# EAGLE schematic XADC_Example (EAGLE 6.2)
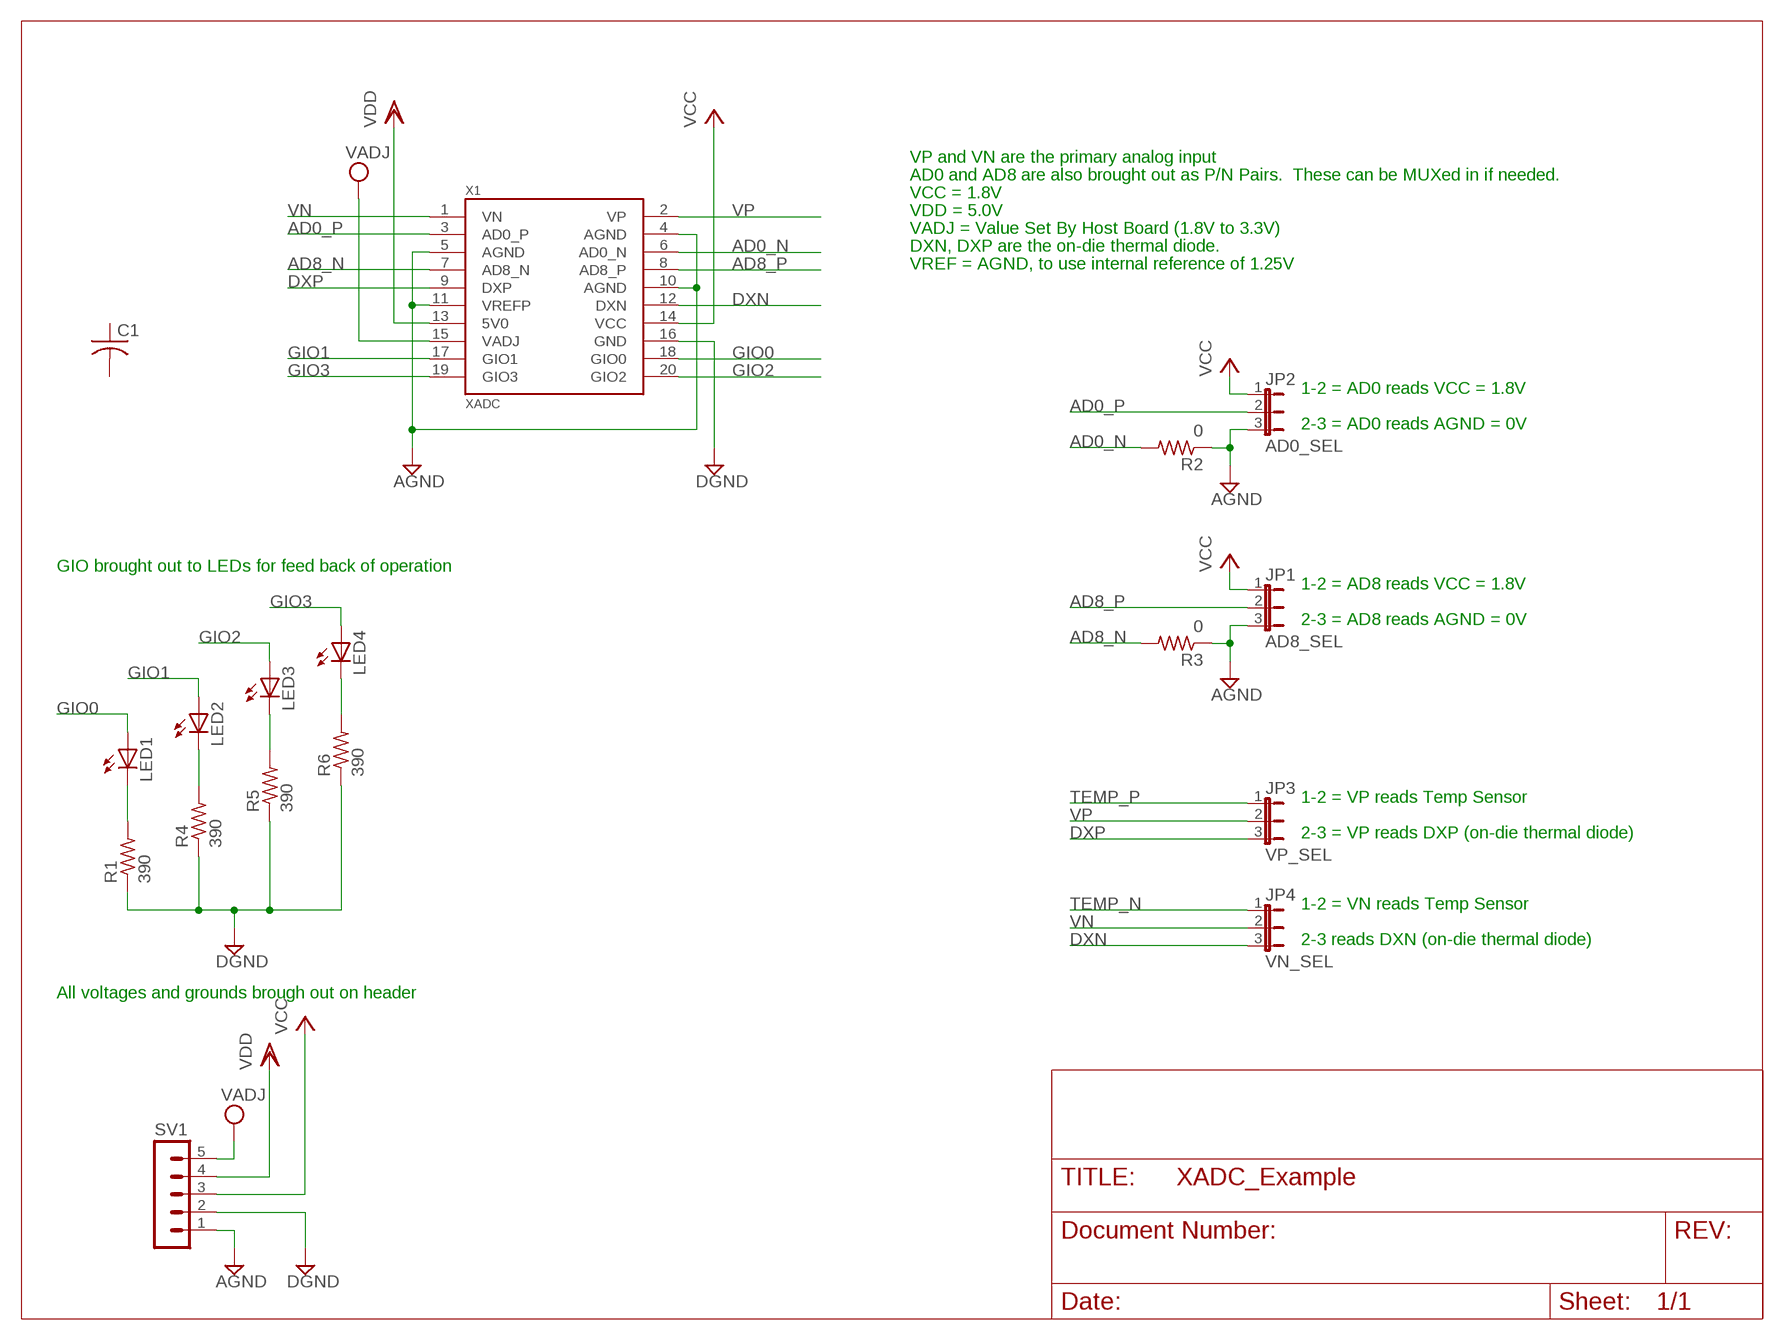
[diagram p0: schematic, sheet 1]

## Parts
C1  C-USC0603  [C0603]
JP1  AD8_SEL  JP2E  [JP2]
JP2  AD0_SEL  JP2E  [JP2]
JP3  VP_SEL  JP2E  [JP2]
JP4  VN_SEL  JP2E  [JP2]
LED1  LED5MM  [LED5MM]
LED2  LED5MM  [LED5MM]
LED3  LED5MM  [LED5MM]
LED4  LED5MM  [LED5MM]
R1  390  R-US_R0603  [R0603]
R2  0  R-US_R0603  [R0603]
R3  0  R-US_R0603  [R0603]
R4  390  R-US_R0603  [R0603]
R5  390  R-US_R0603  [R0603]
R6  390  R-US_R0603  [R0603]
SV1  MA05-1  [MA05-1]
X1  XADC  [XADC_2X10]

## Nets
AD0_N: R2.2 X1.6(AD0_N)
AD0_P: JP2.2 X1.3(AD0_P)
AD8_N: R3.2 X1.7(AD8_N)
AD8_P: JP1.2 X1.8(AD8_P)
AGND: JP1.3 JP2.3 R2.1 R3.1 SV1.1 X1.4(AGND) X1.5(AGND) X1.10(AGND) X1.11(VREFP)
DGND: R1.1 R4.1 R5.1 R6.1 SV1.2 X1.16(GND)
DXN: JP4.3 X1.12(DXN)
DXP: JP3.3 X1.9(DXP)
GIO0: LED1.A X1.18(GIO0)
GIO1: LED2.A X1.17(GIO1)
GIO2: LED3.A X1.20(GIO2)
GIO3: LED4.A X1.19(GIO3)
N$5: LED1.K(C) R1.2
N$6: LED2.K(C) R4.2
N$7: LED3.K(C) R5.2
N$8: LED4.K(C) R6.2
TEMP_N: JP4.1
TEMP_P: JP3.1
VCC: JP1.1 JP2.1 SV1.3 X1.14(VCC)
VDD: SV1.4 SV1.5 X1.13(5V0) X1.15(VADJ) ; supply symbol labelled VADJ
VN: JP4.2 X1.1(VN)
VP: JP3.2 X1.2(VP)
Unconnected: C1.1 C1.2

## Notes on the sheet
- VP and VN are the primary analog input
- AD0 and AD8 are also brought out as P/N Pairs.  These can be MUXed in if needed.
- VCC = 1.8V
- VDD = 5.0V
- VADJ = Value Set By Host Board (1.8V to 3.3V)
- DXN, DXP are the on-die thermal diode.
- VREF = AGND, to use internal reference of 1.25V
- 1-2 = AD0 reads VCC = 1.8V
- 2-3 = AD0 reads AGND = 0V
- GIO brought out to LEDs for feed back of operation
- 1-2 = AD8 reads VCC = 1.8V
- 2-3 = AD8 reads AGND = 0V
- 1-2 = VP reads Temp Sensor
- 2-3 = VP reads DXP (on-die thermal diode)
- 1-2 = VN reads Temp Sensor
- 2-3 reads DXN (on-die thermal diode)
- All voltages and grounds brough out on header

## Library data of the parts
C1 = rcl:C-US: CAPACITOR, American symbol
JP1-JP4 = jumper:JP2E: JUMPER
LED1-LED4 = led:LED: LED OSRAM: - CHIPLED LG R971, LG N971, LY N971, LG Q971, LY Q971, LO R971, LY R971 LH N974, LH R974 LS Q976, LO Q976, LY Q976 LO Q996 - Hyper CHIPLED LW Q18S LB Q993, LB Q99A, LB R99A - SideLED LS A670, LO A670, LY A670, LG A670, LP A670 LB A673, LV A673, LT A673, LW A673 LH A674 LY A675 LS A676, LA A676, LO A676, LY A676, LW A676 LS A679, LY A679, LG A679 - Hyper Micro SIDELED® LS Y876, LA Y876, LO Y876, LY Y876 LT Y87S - SmartLED LW L88C, LW L88S LB L89C, LB L89S, LG L890 LS L89K, LO L89K, LY L89K LS L896, LA L896, LO L896, LY L896 - TOPLED LS T670, LO T670, LY T670, LG T670, LP T670 LSG T670, LSP T670, LSY T670, LOP T670, LYG T670 LG T671, LOG T671, LSG T671 LB T673, LV T673, LT T673, LW T673 LH T674 LS T676, LA T676, LO T676, LY T676, LB T676, LH T676, LSB T676, LW T676 LB T67C, LV T67C, LT T67C, LS T67K, LO T67K, LY T67K, LW E67C LS E67B, LA E67B, LO E67B, LY E67B, LB E67C, LV E67C, LT E67C LW T67C LS T679, LY T679, LG T679 LS T770, LO T770, LY T770, LG T770, LP T770 LB T773, LV T773, LT T773, LW T773 LH T774 LS E675, LA E675, LY E675, LS T675 LS T776, LA T776, LO T776, LY T776, LB T776 LHGB T686 LT T68C, LB T68C - Hyper Mini TOPLED® LB M676 - Mini TOPLED Santana® LG M470 LS M47K, LO M47K, LY M47K Source: http://www.osram.convergy.de LUXEON: - LUMILED® LXK2-PW12-R00, LXK2-PW12-S00, LXK2-PW14-U00, LXK2-PW14-V00 LXK2-PM12-R00, LXK2-PM12-S00, LXK2-PM14-U00 LXK2-PE12-Q00, LXK2-PE12-R00, LXK2-PE12-S00, LXK2-PE14-T00, LXK2-PE14-U00 LXK2-PB12-K00, LXK2-PB12-L00, LXK2-PB12-M00, LXK2-PB14-N00, LXK2-PB14-P00, LXK2-PB14-Q00 LXK2-PR12-L00, LXK2-PR12-M00, LXK2-PR14-Q00, LXK2-PR14-R00 LXK2-PD12-Q00, LXK2-PD12-R00, LXK2-PD12-S00 LXK2-PH12-R00, LXK2-PH12-S00 LXK2-PL12-P00, LXK2-PL12-Q00, LXK2-PL12-R00 Source: www.luxeon.com KINGBRIGHT: KA-3528ASYC Source: www.kingbright.com
R1-R6 = rcl:R-US_: RESISTOR, American symbol
SV1 = con-lstb:MA05-1: PIN HEADER; OC_FARNELL: unknown; OC_NEWARK: unknown
X1 = zed-board:XADC